# Altium project IOT_V1.2.PrjPcb
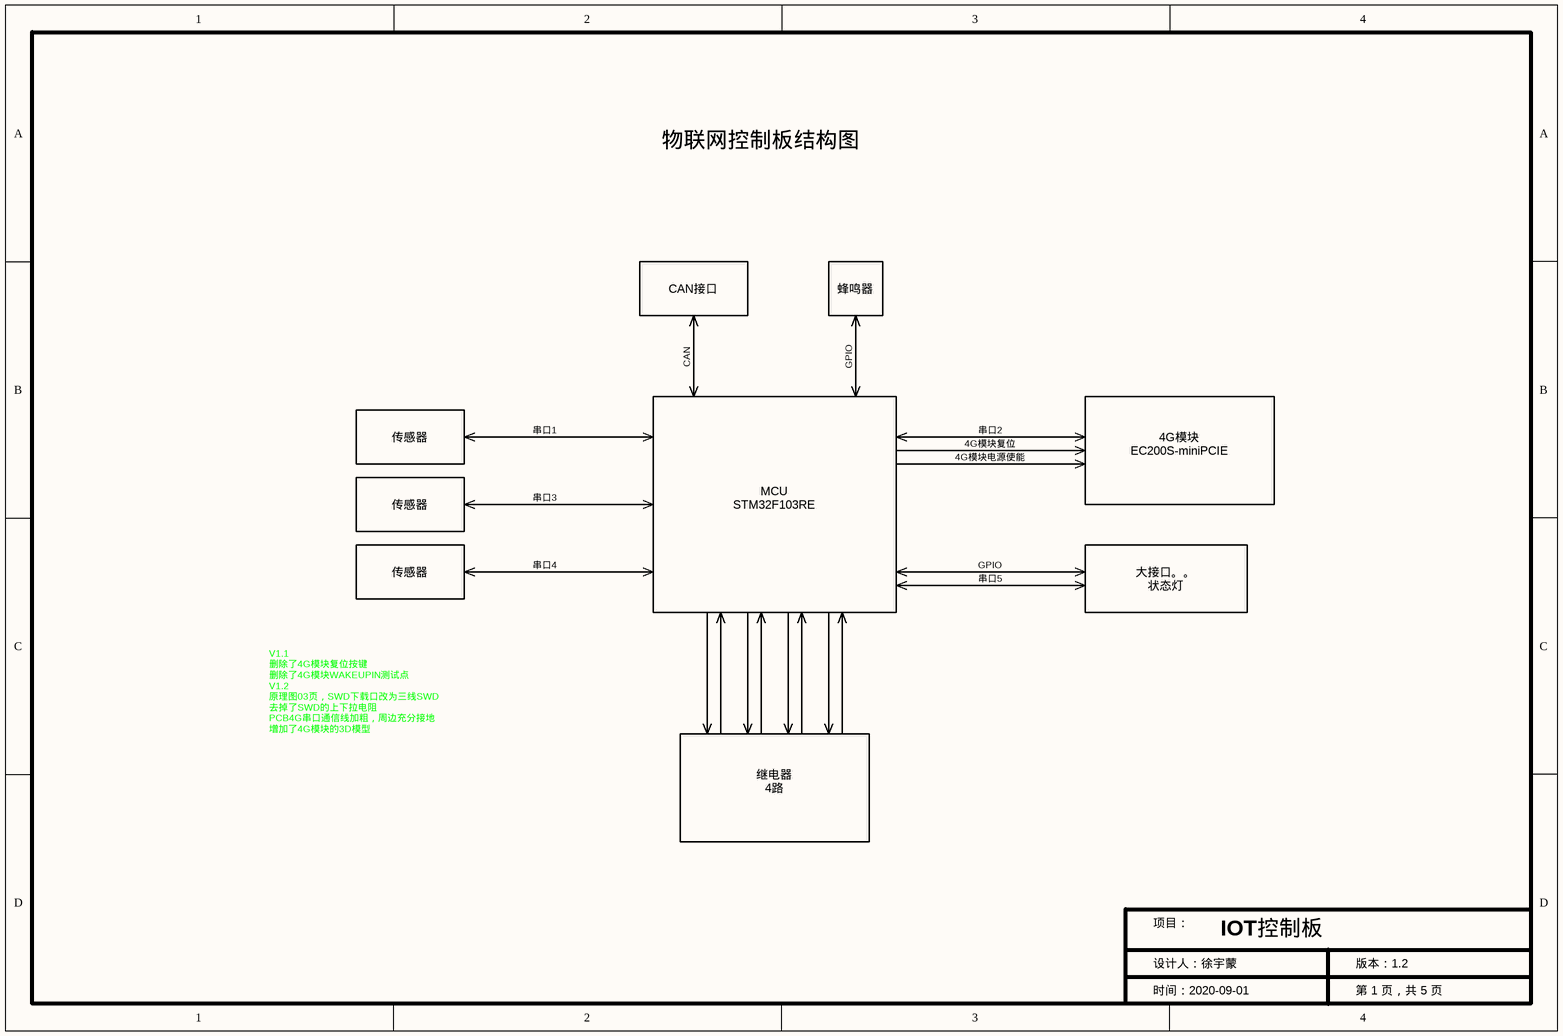
[diagram p0: 01_模块结构图.SchDoc]
5 sheets, 130 parts. Net scope: global (net labels, ports and power ports of the same name join across sheets).
Board file: IOT_V1.2.PcbDoc
Sheets:
  01_模块结构图.SchDoc
  02_电源部分.SchDoc
  03_MCU部分.SchDoc
  04_4G通信模块与外围电路.SchDoc
  05_外部接口与其他部分.SchDoc

## Sheet 01_模块结构图.SchDoc
size A4; DocumentNumber: 1; SheetNumber: 1; SheetTotal: 4

### Notes on the sheet
- 物联网控制板结构图
- CAN接口
- 蜂鸣器
- CAN
- GPIO
- 传感器
- 串口1
- 串口2
- 4G模块复位
- 4G模块
- EC200S-miniPCIE
- 串口3
- MCU
- STM32F103RE
- 4G模块电源使能
- 串口4
- 串口5
- 大接口。。
- 状态灯
- 继电器
- 4路
- V1.1
  删除了4G模块复位按键
  删除了4G模块WAKEUPIN测试点
  V1.2
  原理图03页，SWD下载口改为三线SWD
  去掉了SWD的上下拉电阻
  PCB4G串口通信线加粗，周边充分接地
  增加了4G模块的3D模型
- 项目：
- IOT控制板
- 时间：2020-09-01
- 设计人：徐宇蒙
- 第 1 页，共 5 页
- 版本：1.2

## Sheet 02_电源部分.SchDoc
size A4; DocumentNumber: 2; SheetNumber: 2; SheetTotal: 4
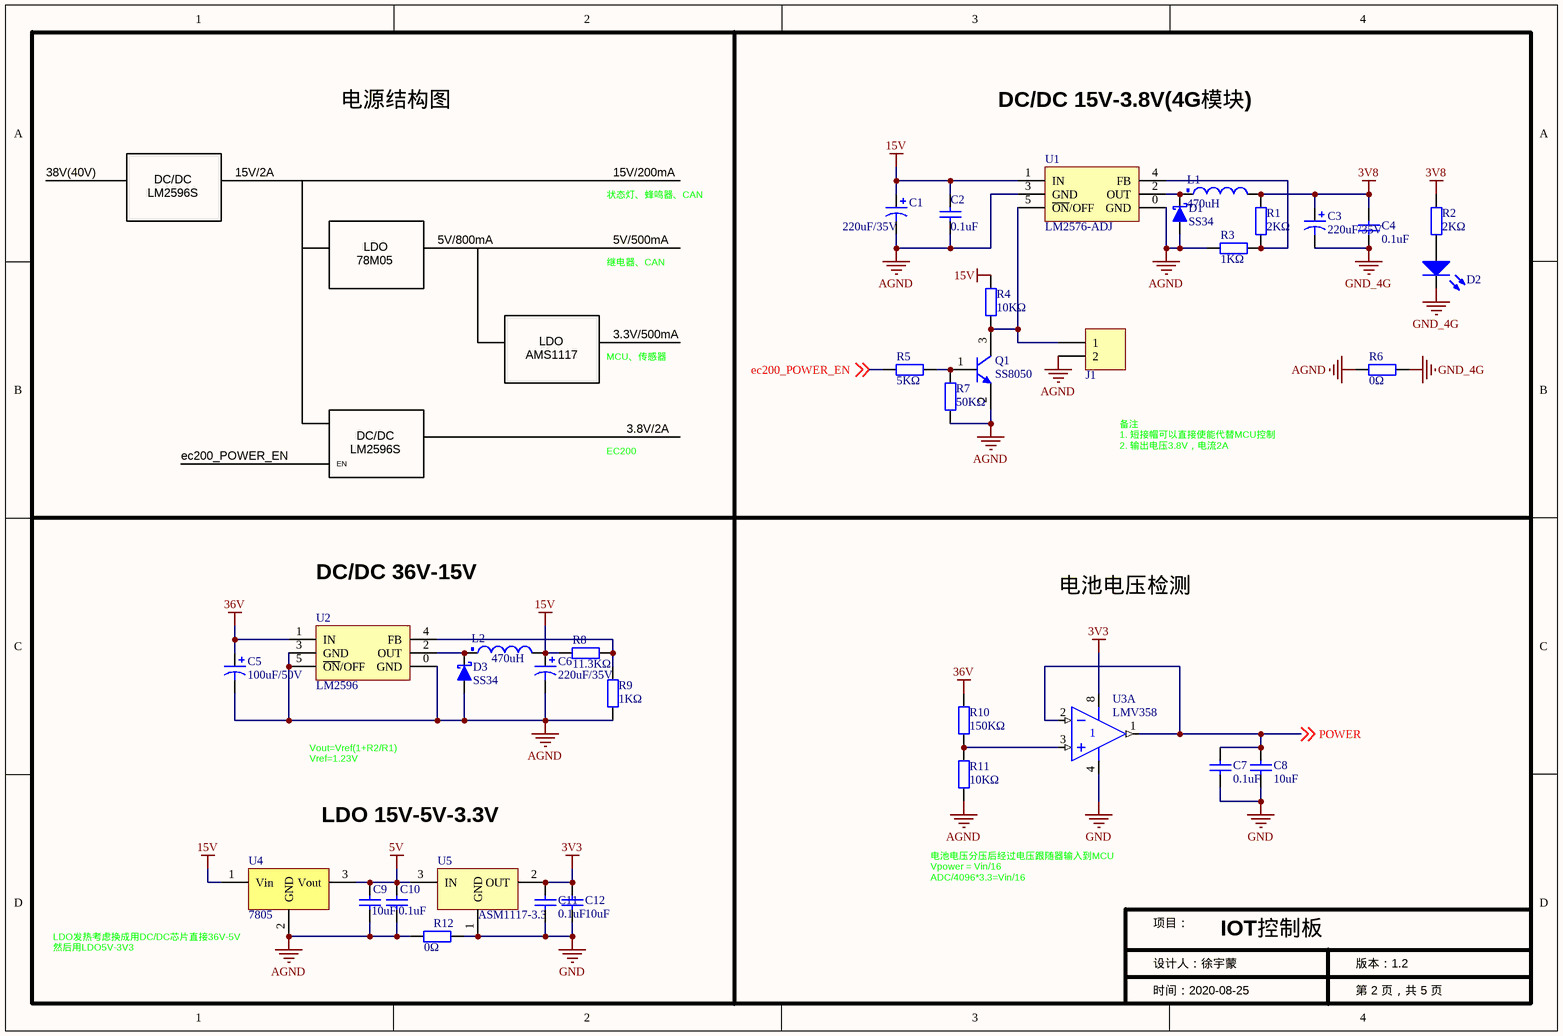
[diagram p1: 02_电源部分.SchDoc]

### Parts
C1  value 220uF/35V  [Cap8x10.5mm]  (hidden comment: Cap Pol)
C2  value 0.1uF  [CAP-0603]  (hidden comment: Cap)
C3  value 220uF/35V  [Cap8x10.5mm]  (hidden comment: Cap Pol)
C4  value 0.1uF  [CAP-0603]  (hidden comment: Cap)
C5  value 100uF/50V  [Cap8x10.5mm]  (hidden comment: Cap Pol)
C6  value 220uF/35V  [Cap8x10.5mm]  (hidden comment: Cap Pol)
C7  value 0.1uF  [CAP-0603]  (hidden comment: Cap)
C8  value 10uF  [CAP-0603]  (hidden comment: Cap)
C9  value 10uF  [CAP-0603]  (hidden comment: Cap)
C10  value 0.1uF  [CAP-0603]  (hidden comment: Cap)
C11  value 0.1uF  [CAP-0603]  (hidden comment: Cap)
C12  value 10uF  [CAP-0603]  (hidden comment: Cap)
D1  SS34  [SMA(DO-214AC)]
D2  LED  [LED_0805]  (value not drawn)
D3  SS34  [SMA(DO-214AC)]
J1  Header 2  [Header_2X1_2.54]  (value not drawn)
L1  value 470uH  [CD43]  (hidden comment: Inductor)
L2  value 470uH  [CD43]  (hidden comment: Inductor)
Q1  SS8050  [SOT-23]
R1  value 2KΩ  [0603]  (hidden comment: Res)
R2  value 2KΩ  [0603]  (hidden comment: Res)
R3  value 1KΩ  [0603]  (hidden comment: Res)
R4  value 10KΩ  [0603]  (hidden comment: Res)
R5  value 5KΩ  [0603]  (hidden comment: Res)
R6  value 0Ω  [0805]  (hidden comment: Res)
R7  value 50KΩ  [0603]  (hidden comment: Res)
R8  value 11.3KΩ  [0603]  (hidden comment: Res)
R9  value 1KΩ  [0603]  (hidden comment: Res)
R10  value 150KΩ  [0603]  (hidden comment: Res)
R11  value 10KΩ  [0603]  (hidden comment: Res)
R12  value 0Ω  [0805]  (hidden comment: Res)
U1  LM2576-ADJ  [TO-263-5 无背面散热]
U2  LM2596  [TO-263-5 无背面散热]
U3  LMV358  [OPA2350]  (part A of 2)
U4  7805  [TO-252]
U5  ASM1117-3.3  [SOT-223]

### Nets
3V3: C11.2 C12.2 U3.8(V+) U5.2(OUT)
3V8: C3.1 C4.2 L1.2 R1.1 R2.2
5V: C9.2 C10.2 U4.3(Vout) U5.3(IN)
15V: C1.1 C2.2 C6.1 L2.2 R4.1 R8.1 U1.1(IN) U4.1(Vin)
36V: C5.1 R10.2 U2.1(IN)
AGND: C1.2 C2.1 C5.2 C6.2 C9.1 C10.1 D1.1(A) D3.1(A) J1.2 Q1.2(E) R3.1 R6.1 R7.2 R9.1 R11.1 R12.1 U1.0(GND) U1.3(GND) U2.0(GND) U2.3(GND) U2.5(~{ON}/OFF) U4.2(GND)
GND: C7.1 C8.1 C11.1 C12.1 R12.2 U3.4(V-) U5.1(GND)
GND_4G: C3.2 C4.1 D2.2(K) R6.2
ec200_POWER_EN: R5.1 ; off-sheet ec200_POWER_EN  [project net PA1]
POWER: C7.2 C8.2 U3.1(OUT) U3.2(IN-) ; off-sheet POWER  [project net PC0]
NetD1_2: D1.2(K) L1.1 U1.2(OUT)
NetD2_1: D2.1(A) R2.1
NetD3_2: D3.2(K) L2.1 U2.2(OUT)
NetJ1_1: J1.1 Q1.3(C) R4.2 U1.5(~{ON}/OFF)
NetQ1_1: Q1.1(B) R5.2 R7.1
NetR1_2: R1.2 R3.2 U1.4(FB)
NetR8_2: R8.2 R9.2 U2.4(FB)
NetR10_1: R10.1 R11.2 U3.3(IN+)

### Notes on the sheet
- 电源结构图
- DC/DC 15V-3.8V(4G模块)
- 38V(40V)
- 15V/2A
- 15V/200mA
- LM2596S
- DC/DC
- LDO
- 5V/800mA
- 状态灯、蜂鸣器、CAN
- 5V/500mA
- 78M05
- 继电器、CAN
- AMS1117
- MCU、传感器
- 3.3V/500mA
- 3.8V/2A
- ec200_POWER_EN
- EN
- EC200
- 备注
  1. 短接帽可以直接使能代替MCU控制
  2. 输出电压3.8V，电流2A
- DC/DC 36V-15V
- 电池电压检测
- Vout=Vref(1+R2/R1)
  Vref=1.23V
- LDO 15V-5V-3.3V
- 电池电压分压后经过电压跟随器输入到MCU
  Vpower = Vin/16
  ADC/4096*3.3=Vin/16
- 项目：
- IOT控制板
- (near U4) LDO发热考虑换成用DC/DC芯片直接36V-5V
  然后用LDO5V-3V3
- 设计人：徐宇蒙
- 时间：2020-08-25
- 第 2 页，共 5 页
- 版本：1.2

### Library data of the parts
C1 C3 C5 C6 = Cap Pol: 贴片电解电容 8*10.5mm; Published: 8-Jun-2000; LatestRevisionDate: 17-Jul-2002; LatestRevisionNote: Re-released for DXP Platform.; PackageReference: POLAR0.8; Publisher: Altium Limited
C2 C4 C7-C12 = Cap: 无极性电容; Published: 8-Jun-2000; LatestRevisionDate: 17-Jul-2002; LatestRevisionNote: Re-released for DXP Platform.; PackageReference: RAD-0.3; Publisher: Altium Limited
D1 D3 = D Schottky: Schottky Diode; Published: 8-Jun-2000; LatestRevisionDate: 17-Jul-2002; LatestRevisionNote: Re-released for DXP Platform.; PackageReference: SMB; Publisher: Altium Limited; Code_JEDEC: DO-214-AA
D2 = LED: 发光二极管; Published: 8-Jun-2000; LatestRevisionDate: 08-Jul-2005; LatestRevisionNote: Mech Layer 1 removed.; PackageReference: LED-0; Publisher: Altium Limited
J1 = Header 2: 接插件; LatestRevisionDate: 17-Jul-2002; LatestRevisionNote: Re-released for DXP Platform.; Publisher: Altium Limited
L1 L2 = Inductor: 贴片功率电感; Code_IEC: 1005; Published: 8-Jun-2000; LatestRevisionDate: 17-Jul-2002; LatestRevisionNote: Re-released for DXP Platform.; PackageReference: 0402-A; Publisher: Altium Limited; Code_JEITA: 0402
Q1 = SS8050: NPN贴片三极管; Published: 8-Jun-2000; LatestRevisionDate: 15-Jan-2003; LatestRevisionNote: PCB Footprint 'BCY-W3/D4.7' replaced; DatasheetDocument: 1997; PackageDocument: Sep-1998; PackageReference: TO-92A; Publisher: Altium Limited; Code_JEDEC: TO-92A; ComponentLink1Description: Manufacturer Link; ComponentLink1URL: http://www.fairchildsemi.com/; ComponentLink2Description: Datasheet; ComponentLink2URL: http://www.fairchildsemi.com/ds/2N%2F2N3904.pdf
R1-R12 = Res: 贴片电阻; Published: 8-Jun-2000; LatestRevisionDate: 17-Jul-2002; LatestRevisionNote: Re-released for DXP Platform.; PackageReference: AXIAL-0.4; Publisher: Altium Limited
U1 = LM2576
U2 = LM2596: DC/DC
U4 = 7805: 三端稳压器7805
U5 = ASM1117: 3.3V稳压芯片
U3 = LMV358: Published: 17-Jul-2002; LatestRevisionDate: 13-Apr-2006; LatestRevisionNote: IPC-7351 Footprint Added.; DatasheetVersion: 1988; PackageReference: 751-02; Publisher: Altium Limited; PackageDescription: 8-Pin Small Outline Integrated Circuit 1.27 mm Pitch; Code_JEDEC: MS-012-AA; Code_IPC: SOIC127P600-8; ComponentLink1Description: Manufacturer Link; ComponentLink1URL: http://www.onsemi.com/site/products/parametrics/0,4446,251,00.html; ComponentLink2Description: Datasheet; ComponentLink2URL: http://www.onsemi.com/pub/Collateral/LM358-D.PDF

## Sheet 03_MCU部分.SchDoc
size A4; DocumentNumber: 3; SheetNumber: 3; SheetTotal: 4
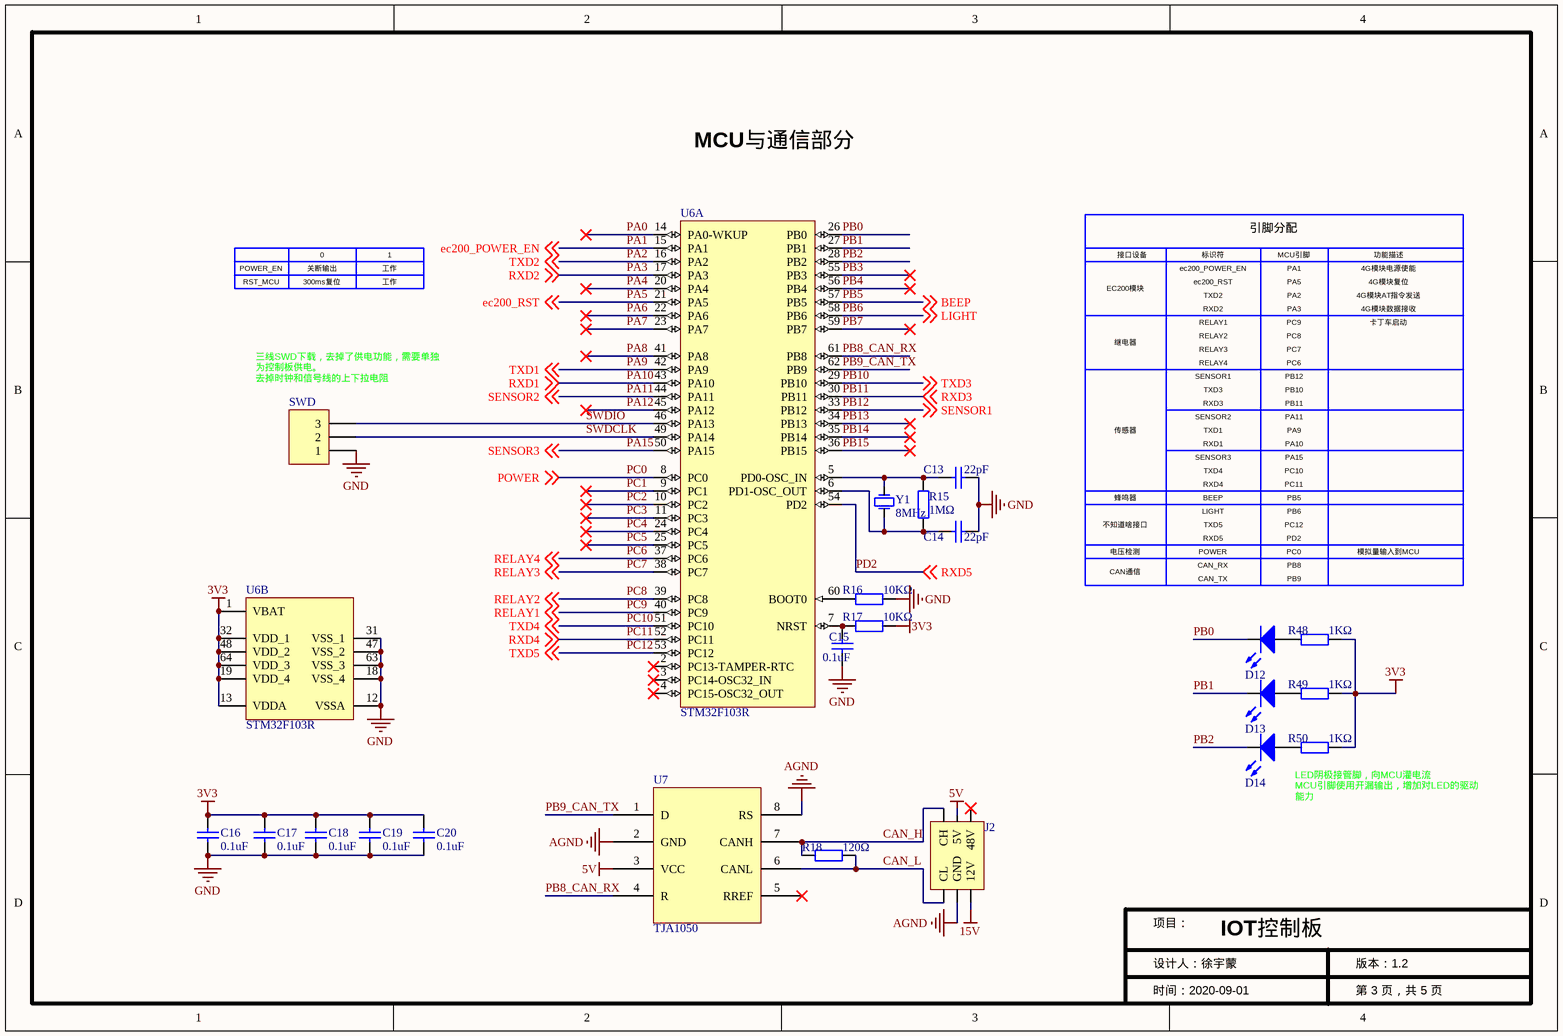
[diagram p2: 03_MCU部分.SchDoc]

### Parts
C13  value 22pF  [CAP-0603]  (hidden comment: Cap)
C14  value 22pF  [CAP-0603]  (hidden comment: Cap)
C15  value 0.1uF  [CAP-0603]  (hidden comment: Cap)
C16  value 0.1uF  [CAP-0603]  (hidden comment: Cap)
C17  value 0.1uF  [CAP-0603]  (hidden comment: Cap)
C18  value 0.1uF  [CAP-0603]  (hidden comment: Cap)
C19  value 0.1uF  [CAP-0603]  (hidden comment: Cap)
C20  value 0.1uF  [CAP-0603]  (hidden comment: Cap)
D12  LED  [LED_0805]  (value not drawn)
D13  LED  [LED_0805]  (value not drawn)
D14  LED  [LED_0805]  (value not drawn)
J2  标准接口  [标准接口-直插-灰色]  (value not drawn)
R15  value 1MΩ  [0603]  (hidden comment: Res)
R16  value 10KΩ  [0603]  (hidden comment: Res)
R17  value 10KΩ  [0603]  (hidden comment: Res)
R18  value 120Ω  [0603]  (hidden comment: Res)
R48  value 1KΩ  [0603]  (hidden comment: Res)
R49  value 1KΩ  [0603]  (hidden comment: Res)
R50  value 1KΩ  [0603]  (hidden comment: Res)
SWD  Header3  [Header_3X1_2.54_排针]  (value not drawn)
U6  STM32F103R  [LQFP64]  (parts A,B of 2)
U7  TJA1050  [TJA1050]
Y1  value 8MHz  [X-SM49]  (hidden comment: XTAL)

### Nets
3V3: C16.2 C17.2 C18.2 C19.2 C20.2 R17.1 R48.1 R49.1 R50.1 U6.1(VBAT) U6.13(VDDA) U6.19(VDD_4) U6.32(VDD_1) U6.48(VDD_2) U6.64(VDD_3)
5V: J2.3(5V) U7.3(VCC)
15V: J2.2(12V)
AGND: J2.4(GND) U7.2(GND) U7.8(RS)
GND: C13.1 C14.1 C15.1 C16.1 C17.1 C18.1 C19.1 C20.1 R16.1 SWD.1 U6.12(VSSA) U6.18(VSS_4) U6.31(VSS_1) U6.47(VSS_2) U6.63(VSS_3)
CAN_H: J2.5(CH) R18.2 U7.7(CANH)
CAN_L: J2.6(CL) R18.1 U7.6(CANL)
PA0: U6.14(PA0-WKUP)
PA1: U6.15(PA1) ; off-sheet ec200_POWER_EN  [also labelled ec200_POWER_EN]
PA2: U6.16(PA2) ; off-sheet TXD2  [also labelled TXD2]
PA3: U6.17(PA3) ; off-sheet RXD2  [also labelled RXD2]
PA4: U6.20(PA4)
PA5: U6.21(PA5) ; off-sheet ec200_RST  [also labelled ec200_RST]
PA6: U6.22(PA6)
PA7: U6.23(PA7)
PA8: U6.41(PA8)
PA9: U6.42(PA9) ; off-sheet TXD1  [also labelled TXD1]
PA10: U6.43(PA10) ; off-sheet RXD1  [also labelled RXD1]
PA11: U6.44(PA11) ; off-sheet SENSOR2  [also labelled SENSOR2]
PA12: U6.45(PA12)
PA15: U6.50(PA15) ; off-sheet SENSOR3  [also labelled SENSOR3]
PB0: D12.2(K) U6.26(PB0)
PB1: D13.2(K) U6.27(PB1)
PB2: D14.2(K) U6.28(PB2)
PB3: U6.55(PB3)
PB4: U6.56(PB4)
PB5: U6.57(PB5) ; off-sheet BEEP  [also labelled BEEP]
PB6: U6.58(PB6) ; off-sheet LIGHT  [also labelled LIGHT]
PB7: U6.59(PB7)
PB8_CAN_RX: U6.61(PB8) U7.4(R)
PB9_CAN_TX: U6.62(PB9) U7.1(D)
PB10: U6.29(PB10) ; off-sheet TXD3  [also labelled TXD3]
PB11: U6.30(PB11) ; off-sheet RXD3  [also labelled RXD3]
PB12: U6.33(PB12) ; off-sheet SENSOR1  [also labelled SENSOR1]
PB13: U6.34(PB13)
PB14: U6.35(PB14)
PB15: U6.36(PB15)
PC0: U6.8(PC0) ; off-sheet POWER  [also labelled POWER]
PC1: U6.9(PC1)
PC2: U6.10(PC2)
PC3: U6.11(PC3)
PC4: U6.24(PC4)
PC5: U6.25(PC5)
PC6: U6.37(PC6) ; off-sheet RELAY4  [also labelled RELAY4]
PC7: U6.38(PC7) ; off-sheet RELAY3  [also labelled RELAY3]
PC8: U6.39(PC8) ; off-sheet RELAY2  [also labelled RELAY2]
PC9: U6.40(PC9) ; off-sheet RELAY1  [also labelled RELAY1]
PC10: U6.51(PC10) ; off-sheet TXD4  [also labelled TXD4]
PC11: U6.52(PC11) ; off-sheet RXD4  [also labelled RXD4]
PC12: U6.53(PC12) ; off-sheet TXD5  [also labelled TXD5]
PD2: U6.54(PD2) ; off-sheet RXD5  [also labelled RXD5]
SWDCLK: SWD.2 U6.49(PA14)
SWDIO: SWD.3 U6.46(PA13)
NetC13_2: C13.2 R15.2 U6.5(PD0-OSC_IN) Y1.2
NetC14_2: C14.2 R15.1 U6.6(PD1-OSC_OUT) Y1.1
NetC15_2: C15.2 R17.2 U6.7(NRST)
NetD12_1: D12.1(A) R48.2
NetD13_1: D13.1(A) R49.2
NetD14_1: D14.1(A) R50.2
NetR16_2: R16.2 U6.60(BOOT0)

Not connected (* = marked no-connect by the designer): J2 1(48V)*; U6 2(PC13-TAMPER-RTC)* 3(PC14-OSC32_IN)* 4(PC15-OSC32_OUT)*; U7 5(RREF)*

### Notes on the sheet
- MCU与通信部分
- 0
- 1
- 接口设备
- 标识符
- 引脚分配
- MCU引脚
- 功能描述
- POWER_EN
- RST_MCU
- 关断输出
- 300ms复位
- 工作
- EC200模块
- ec200_POWER_EN
- ec200_RST
- TXD2
- RXD2
- PA1
- PA5
- PA2
- PA3
- 4G模块电源使能
- 4G模块复位
- 4G模块AT指令发送
- 4G模块数据接收
- 继电器
- RELAY1
- RELAY2
- RELAY3
- RELAY4
- SENSOR1
- TXD3
- PB10
- PB12
- PC6
- PC7
- PC8
- PC9
- 卡丁车启动
- (near SWD) 三线SWD下载，去掉了供电功能，需要单独为控制板供电。
  去掉时钟和信号线的上下拉电阻
- 传感器
- RXD3
- SENSOR2
- TXD1
- RXD1
- PB11
- PA9
- PA10
- PA11
- 蜂鸣器
- 不知道啥接口
- SENSOR3
- BEEP
- LIGHT
- TXD5
- TXD4
- RXD4
- PC12
- PC10
- PC11
- PA15
- PB6
- PB5
- 电压检测
- CAN通信
- RXD5
- POWER
- CAN_RX
- CAN_TX
- PD2
- PC0
- PB8
- PB9
- 模拟量输入到MCU
- LED阴极接管脚，向MCU灌电流
  MCU引脚使用开漏输出，增加对LED的驱动能力
- 项目：
- IOT控制板
- 设计人：徐宇蒙
- 时间：2020-09-01
- 第 3 页，共 5 页
- 版本：1.2

### Library data of the parts
C13-C20 = Cap: 无极性电容; Published: 8-Jun-2000; LatestRevisionDate: 17-Jul-2002; LatestRevisionNote: Re-released for DXP Platform.; PackageReference: RAD-0.3; Publisher: Altium Limited
D12-D14 = LED: 发光二极管; Published: 8-Jun-2000; LatestRevisionDate: 08-Jul-2005; LatestRevisionNote: Mech Layer 1 removed.; PackageReference: LED-0; Publisher: Altium Limited
R15-R18 R48-R50 = Res: 贴片电阻; Published: 8-Jun-2000; LatestRevisionDate: 17-Jul-2002; LatestRevisionNote: Re-released for DXP Platform.; PackageReference: AXIAL-0.4; Publisher: Altium Limited
SWD = Header3: 接插件
U6 = STM32F103R: STM32单片机64引脚; PartNumber: STM32F103RGT6; A/D Converter: 3x12-bit (16 Channel); Core: ARM Cortex-M3; D/A Converter: 2x12-bit (2 Channel); FLASH Size (Prog) (kB): 1024; I/Os (High Current): 51; Internal RAM Size (kB): 96; Operating Frequency(F) (Processor speed) (MHz): 72; Packing: Tray; Supply Voltage(Vcc) min (V): 2; DatasheetVersion: Rev. 3; PackageVersion: Rev. 4, 06/2013; PackageReference: LQFP64; PackageDescription: 64-Pin Low Profile Quad Flat Package, 10 x 10 mm Body, 0.5 mm Pitch; Supplier 1: Digi-Key; Supplier Part Number 1: 497-11118-ND; Supplier 2: Farnell; Supplier Part Number 2: 2215220; Supplier 3: Newark; Supplier Part Number 3: 21T4016; Supplier 4: Mouser; Supplier Part Number 4: 511-STM32F103RGT6; Mounting Technology: Surface Mount; ComponentLink1Description: Manufacturer URL; ComponentLink1URL: http://www.st.com/web/en/home.html; ComponentLink2Description: Datasheet; ComponentLink2URL: http://www.st.com/st-web-ui/static/active/en/resource/technical/document/datasheet/CD00253742.pdf; ComponentLink3Description: Package Specification; ComponentLink3URL: http://www.st.com/st-web-ui/static/active/en/resource/technical/document/datasheet/DM00037051.pdf
U7 = TJA1050: CAN收发器芯片
Y1 = XTAL: 晶振; Published: 8-Jun-2000; LatestRevisionDate: 17-Jul-2002; LatestRevisionNote: Re-released for DXP Platform.; PackageReference: R38; Publisher: Altium Limited

## Sheet 04_4G通信模块与外围电路.SchDoc
size A4; DocumentNumber: 4; SheetNumber: 4; SheetTotal: 4
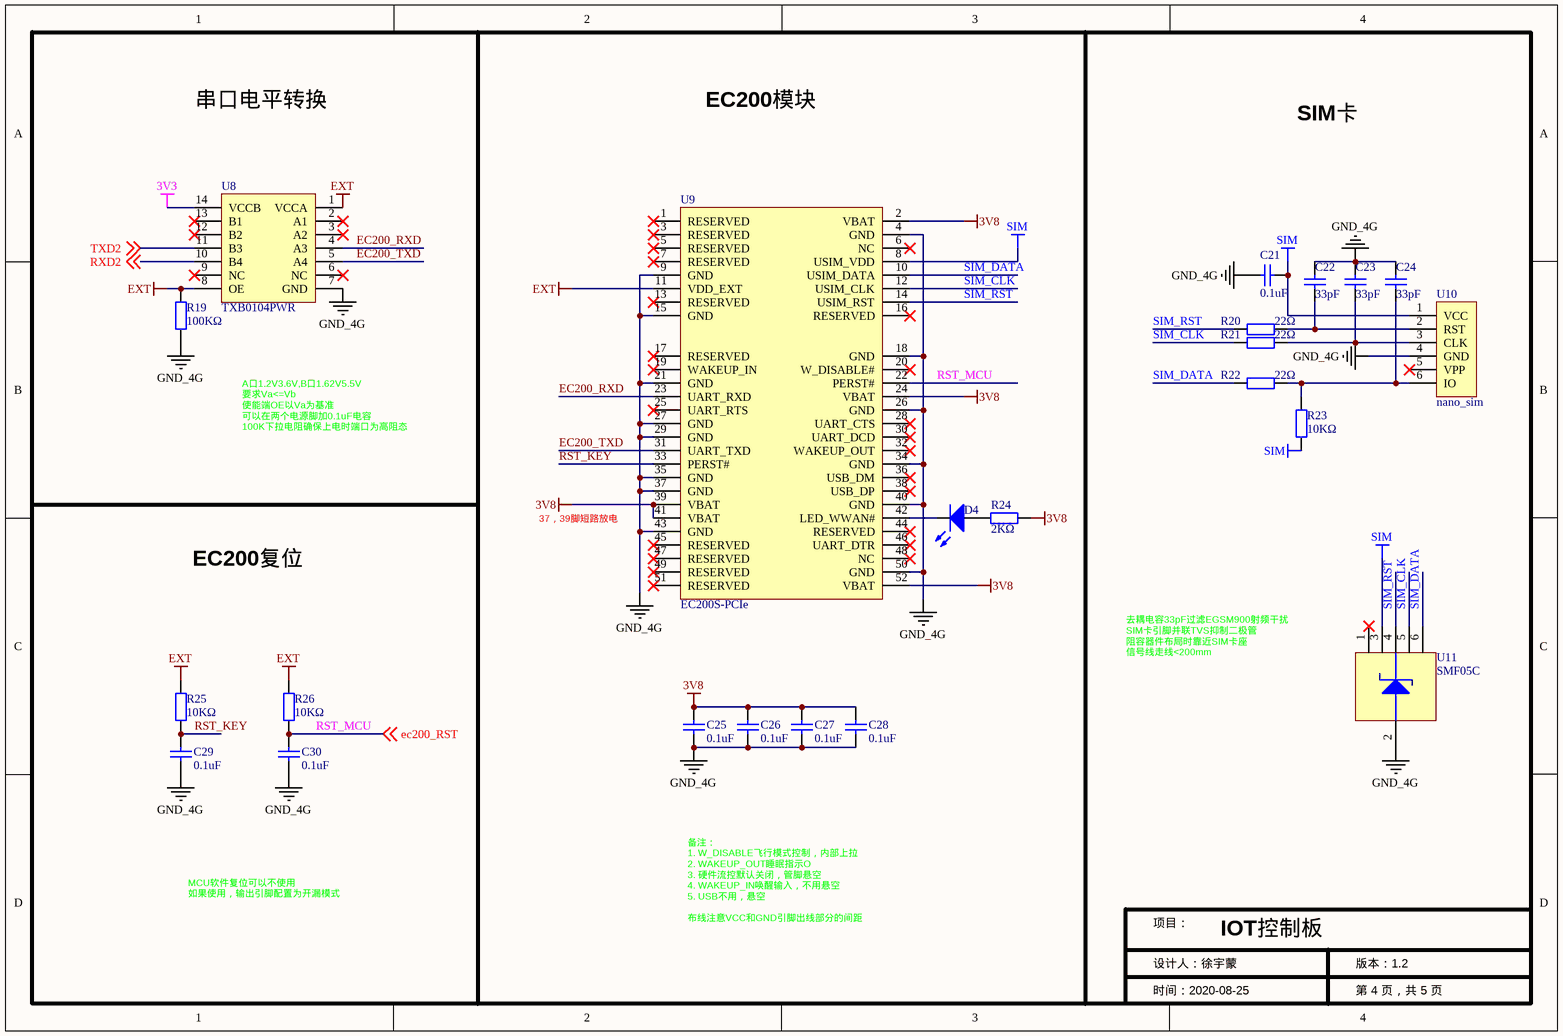
[diagram p3: 04_4G通信模块与外围电路.SchDoc]

### Parts
C21  value 0.1uF  [CAP-0603]  (hidden comment: Cap)
C22  value 33pF  [CAP-0603]  (hidden comment: Cap)
C23  value 33pF  [CAP-0603]  (hidden comment: Cap)
C24  value 33pF  [CAP-0603]  (hidden comment: Cap)
C25  value 0.1uF  [CAP-0603]  (hidden comment: Cap)
C26  value 0.1uF  [CAP-0603]  (hidden comment: Cap)
C27  value 0.1uF  [CAP-0603]  (hidden comment: Cap)
C28  value 0.1uF  [CAP-0603]  (hidden comment: Cap)
C29  value 0.1uF  [CAP-0603]  (hidden comment: Cap)
C30  value 0.1uF  [CAP-0603]  (hidden comment: Cap)
D4  LED  [LED_0805]  (value not drawn)
R19  value 100KΩ  [0603]  (hidden comment: Res)
R20  value 22Ω  [0603]  (hidden comment: Res)
R21  value 22Ω  [0603]  (hidden comment: Res)
R22  value 22Ω  [0603]  (hidden comment: Res)
R23  value 10KΩ  [0603]  (hidden comment: Res)
R24  value 2KΩ  [0603]  (hidden comment: Res)
R25  value 10KΩ  [0603]  (hidden comment: Res)
R26  value 10KΩ  [0603]  (hidden comment: Res)
U8  TXB0104PWR  [TSSOP-14]
U9  EC200S-PCIe  [miniPCIe1]
U10  nano_sim  [Nano_SIM_6P]
U11  SMF05C  [SOT-363]

### Nets
3V3: U8.14(VCCB)
3V8: C25.2 C26.2 C27.2 C28.2 R24.1 U9.2(VBAT) U9.24(VBAT) U9.39(VBAT) U9.41(VBAT) U9.52(VBAT)
EXT: R19.2 R25.2 R26.1 U8.1(VCCA) U8.8(OE) U9.11(VDD_EXT)
GND_4G: C21.2 C22.1 C23.1 C24.2 C25.1 C26.1 C27.1 C28.1 C29.1 C30.2 R19.1 U8.7(GND) U9.4(GND) U9.9(GND) U9.15(GND) U9.18(GND) U9.21(GND) U9.26(GND) U9.27(GND) U9.29(GND) U9.34(GND) U9.35(GND) U9.37(GND) U9.40(GND) U9.43(GND) U9.50(GND) U10.4(GND) U11.2(gnd)
SIM: C21.1 R23.2 U9.8(USIM_VDD) U10.1(VCC) U11.3(gnd)
ec200_RST: C30.1 R26.2 U9.22(PERST#) ; off-sheet ec200_RST  [also labelled RST_MCU]  [project net PA5]
EC200_RXD: U8.4(A3) U9.23(UART_RXD)
EC200_TXD: U8.5(A4) U9.31(UART_TXD)
RST_KEY: C29.2 R25.1 U9.33(PERST#)
RXD2: U8.10(B4) ; off-sheet RXD2  [project net PA3]
SIM_CLK: R21.1 U9.12(USIM_CLK) U11.5(gnd)
SIM_DATA: R22.1 U9.10(USIM_DATA) U11.6(gnd)
SIM_RST: R20.1 U9.14(USIM_RST) U11.4(gnd)
TXD2: U8.11(B3) ; off-sheet TXD2  [project net PA2]
NetC22_2: C22.2 R20.2 U10.2(RST)
NetC23_2: C23.2 R21.2 U10.3(CLK)
NetC24_1: C24.1 R22.2 R23.1 U10.6(IO)
NetD4_1: D4.1(A) R24.2
NetD4_2: D4.2(K) U9.42(LED_WWAN#)

Not connected (* = marked no-connect by the designer): U8 2(A1)* 3(A2)* 6(NC)* 9(NC)* 12(B2)* 13(B1)*; U9 1(RESERVED)* 3(RESERVED)* 5(RESERVED)* 6(NC)* 7(RESERVED)* 13(RESERVED)* 16(RESERVED)* 17(RESERVED)* 19(WAKEUP_IN)* 20(W_DISABLE#)* 25(UART_RTS)* 28(UART_CTS)* 30(UART_DCD)* 32(WAKEUP_OUT)* 36(USB_DM)* 38(USB_DP)* 44(RESERVED)* 45(RESERVED)* 46(UART_DTR)* 47(RESERVED)* 48(NC)* 49(RESERVED)* 51(RESERVED)*; U10 5(VPP)*; U11 1(gnd)*

### Notes on the sheet
- 串口电平转换
- EC200模块
- SIM卡
- A口1.2V3.6V,B口1.62V5.5V
  要求Va<=Vb
  使能端OE以Va为基准
  可以在两个电源脚加0.1uF电容
  100K下拉电阻确保上电时端口为高阻态
- EC200复位
- (near U9) 37，39脚短路放电
- (near U11) 去耦电容33pF过滤EGSM900射频干扰
  SIM卡引脚并联TVS抑制二极管
  阻容器件布局时靠近SIM卡座
  信号线走线<200mm
- MCU软件复位可以不使用
  如果使用，输出引脚配置为开漏模式
- 项目：
- IOT控制板
- 备注：
  1. W_DISABLE飞行模式控制，内部上拉
  2. WAKEUP_OUT睡眠指示O
  3. 硬件流控默认关闭，管脚悬空
  4. WAKEUP_IN唤醒输入，不用悬空
  5. USB不用，悬空
  布线注意VCC和GND引脚出线部分的间距
- 设计人：徐宇蒙
- 时间：2020-08-25
- 第 4 页，共 5 页
- 版本：1.2

### Library data of the parts
C21-C30 = Cap: 无极性电容; Published: 8-Jun-2000; LatestRevisionDate: 17-Jul-2002; LatestRevisionNote: Re-released for DXP Platform.; PackageReference: RAD-0.3; Publisher: Altium Limited
D4 = LED: 发光二极管; Published: 8-Jun-2000; LatestRevisionDate: 08-Jul-2005; LatestRevisionNote: Mech Layer 1 removed.; PackageReference: LED-0; Publisher: Altium Limited
R19-R26 = Res: 贴片电阻; Published: 8-Jun-2000; LatestRevisionDate: 17-Jul-2002; LatestRevisionNote: Re-released for DXP Platform.; PackageReference: AXIAL-0.4; Publisher: Altium Limited
U8 = TXB0104PWR: 电平转换芯片
U9 = EC200T-PCIe

## Sheet 05_外部接口与其他部分.SchDoc
size A4
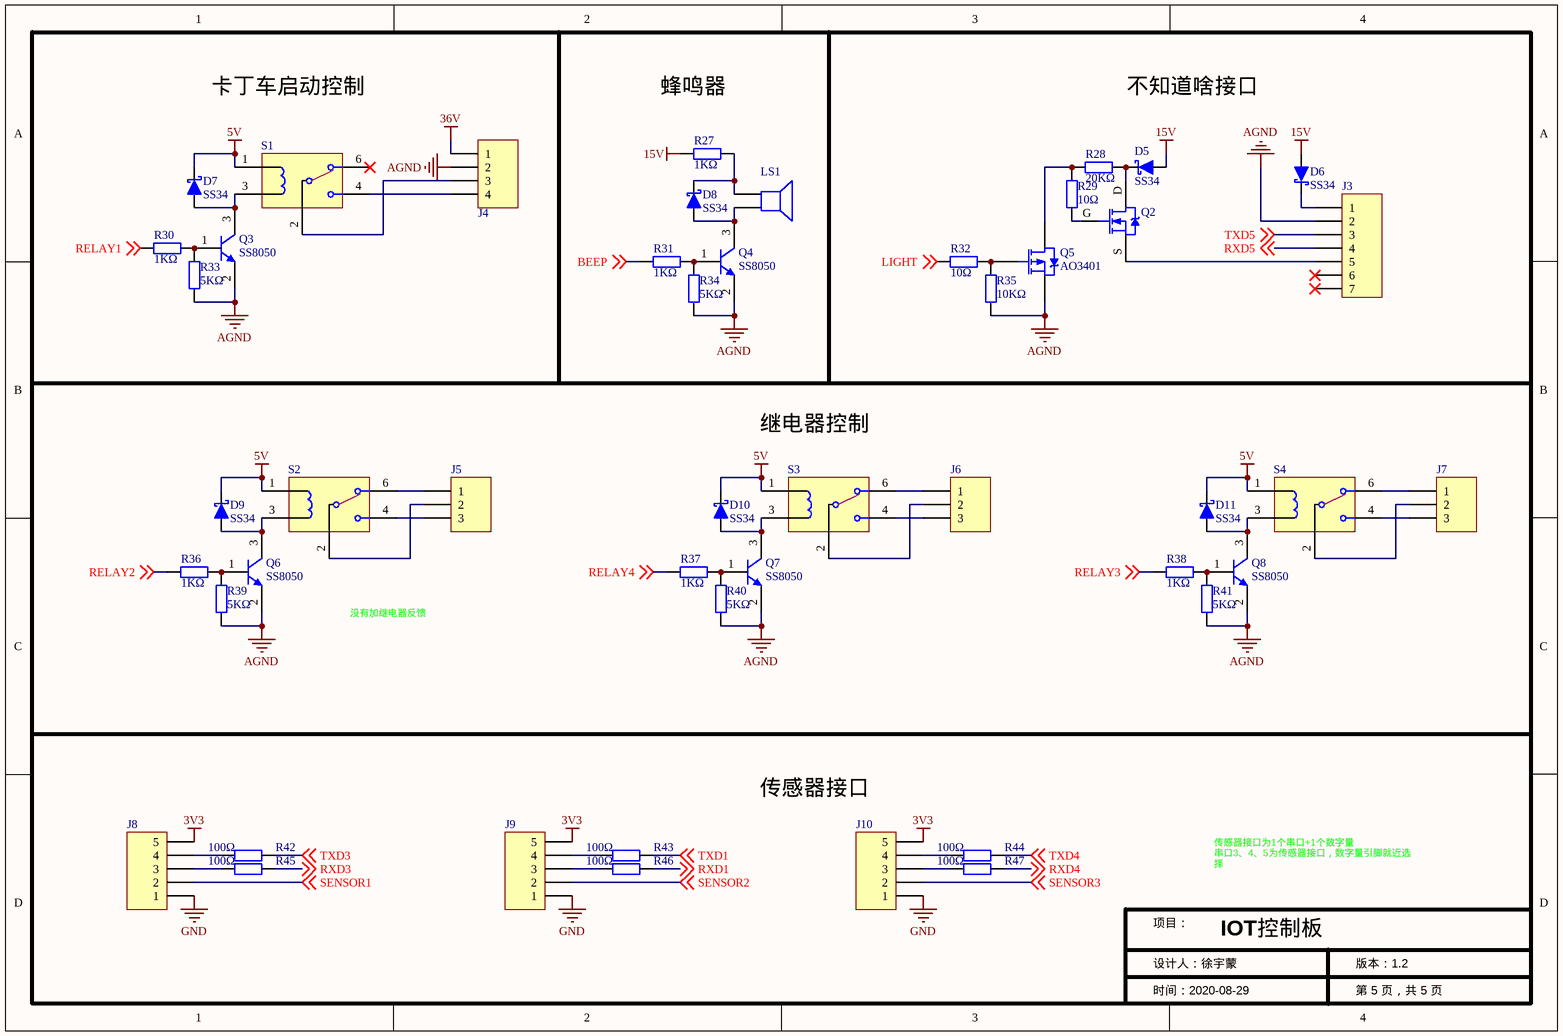
[diagram p4: 05_外部接口与其他部分.SchDoc]

### Parts
D5  SS34  [SMA(DO-214AC)]
D6  SS34  [SMA(DO-214AC)]
D7  SS34  [SMA(DO-214AC)]
D8  SS34  [SMA(DO-214AC)]
D9  SS34  [SMA(DO-214AC)]
D10  SS34  [SMA(DO-214AC)]
D11  SS34  [SMA(DO-214AC)]
J3  Header7  [Header_7X1_XH_2.54_弯针]  (value not drawn)
J4  Header 4  [Header_4P_XH_2.54_弯脚]  (value not drawn)
J5  Header3  [Header_3X1_XH_2.54_弯脚]  (value not drawn)
J6  Header3  [Header_3X1_XH_2.54_弯脚]  (value not drawn)
J7  Header3  [Header_3X1_XH_2.54_弯脚]  (value not drawn)
J8  Header5  [Header_5X1_XH_2.54_弯针]  (value not drawn)
J9  Header5  [Header_5X1_XH_2.54_弯针]  (value not drawn)
J10  Header5  [Header_5X1_XH_2.54_弯针]  (value not drawn)
LS1  蜂鸣器  [蜂鸣器 9*5mm]  (value not drawn)
Q2  AO3400  [SOT-23-MOSFET]  (value not drawn)
Q3  SS8050  [SOT-23]
Q4  SS8050  [SOT-23]
Q5  AO3401  [SOT-23-MOSFET]
Q6  SS8050  [SOT-23]
Q7  SS8050  [SOT-23]
Q8  SS8050  [SOT-23]
R27  value 1KΩ  [0603]  (hidden comment: Res)
R28  value 20KΩ  [0603]  (hidden comment: Res)
R29  value 10Ω  [0603]  (hidden comment: Res)
R30  value 1KΩ  [0603]  (hidden comment: Res)
R31  value 1KΩ  [0603]  (hidden comment: Res)
R32  value 10Ω  [0603]  (hidden comment: Res)
R33  value 5KΩ  [0603]  (hidden comment: Res)
R34  value 5KΩ  [0603]  (hidden comment: Res)
R35  value 10KΩ  [0603]  (hidden comment: Res)
R36  value 1KΩ  [0603]  (hidden comment: Res)
R37  value 1KΩ  [0603]  (hidden comment: Res)
R38  value 1KΩ  [0603]  (hidden comment: Res)
R39  value 5KΩ  [0603]  (hidden comment: Res)
R40  value 5KΩ  [0603]  (hidden comment: Res)
R41  value 5KΩ  [0603]  (hidden comment: Res)
R42  value 100Ω  [0603]  (hidden comment: Res)
R43  value 100Ω  [0603]  (hidden comment: Res)
R44  value 100Ω  [0603]  (hidden comment: Res)
R45  value 100Ω  [0603]  (hidden comment: Res)
R46  value 100Ω  [0603]  (hidden comment: Res)
R47  value 100Ω  [0603]  (hidden comment: Res)
S1  Delay  [SongLe_Relay]  (value not drawn)
S2  Delay  [SongLe_Relay]  (value not drawn)
S3  Delay  [SongLe_Relay]  (value not drawn)
S4  Delay  [SongLe_Relay]  (value not drawn)

### Nets
3V3: J8.5 J9.5 J10.5
5V: D7.2(K) D9.2(K) D10.2(K) D11.2(K) S1.1 S2.1 S3.1 S4.1
15V: D5.1(A) D6.1(A) R27.2
36V: J4.1
AGND: J3.2 J4.2 Q3.2(E) Q4.2(E) Q5.S Q6.2(E) Q7.2(E) Q8.2(E) R33.1 R34.1 R35.1 R39.1 R40.1 R41.1
GND: J8.1 J9.1 J10.1
BEEP: R31.2 ; off-sheet BEEP  [project net PB5]
LIGHT: R32.2 ; off-sheet LIGHT  [project net PB6]
RELAY1: R30.2 ; off-sheet RELAY1  [project net PC9]
RELAY2: R36.2 ; off-sheet RELAY2  [project net PC8]
RELAY3: R38.2 ; off-sheet RELAY3  [project net PC7]
RELAY4: R37.2 ; off-sheet RELAY4  [project net PC6]
RXD1: R46.2 ; off-sheet RXD1  [project net PA10]
RXD3: R45.2 ; off-sheet RXD3  [project net PB11]
RXD4: R47.2 ; off-sheet RXD4  [project net PC11]
RXD5: J3.4 ; off-sheet RXD5  [project net PD2]
SENSOR1: J8.2 ; off-sheet SENSOR1  [project net PB12]
SENSOR2: J9.2 ; off-sheet SENSOR2  [project net PA11]
SENSOR3: J10.2 ; off-sheet SENSOR3  [project net PA15]
TXD1: R43.2 ; off-sheet TXD1  [project net PA9]
TXD3: R42.2 ; off-sheet TXD3  [project net PB10]
TXD4: R44.2 ; off-sheet TXD4  [project net PC10]
TXD5: J3.3 ; off-sheet TXD5  [project net PC12]
NetD5_2: D5.2(K) Q2.D R28.1
NetD6_2: D6.2(K) J3.1
NetD7_1: D7.1(A) Q3.3(C) S1.3
NetD8_1: D8.1(A) LS1.2 Q4.3(C)
NetD8_2: D8.2(K) LS1.1 R27.1
NetD9_1: D9.1(A) Q6.3(C) S2.3
NetD10_1: D10.1(A) Q7.3(C) S3.3
NetD11_1: D11.1(A) Q8.3(C) S4.3
NetJ3_5: J3.5 Q2.S
NetJ4_3: J4.3 S1.2
NetJ4_4: J4.4 S1.4
NetJ5_1: J5.1 S2.6
NetJ5_2: J5.2 S2.2
NetJ5_3: J5.3 S2.4
NetJ6_1: J6.1 S3.6
NetJ6_2: J6.2 S3.2
NetJ6_3: J6.3 S3.4
NetJ7_1: J7.1 S4.6
NetJ7_2: J7.2 S4.2
NetJ7_3: J7.3 S4.4
NetJ8_3: J8.3 R45.1
NetJ8_4: J8.4 R42.1
NetJ9_3: J9.3 R46.1
NetJ9_4: J9.4 R43.1
NetJ10_3: J10.3 R47.1
NetJ10_4: J10.4 R44.1
NetQ2_G: Q2.G R29.2
NetQ3_1: Q3.1(B) R30.1 R33.2
NetQ4_1: Q4.1(B) R31.1 R34.2
NetQ5_D: Q5.D R28.2 R29.1
NetQ5_G: Q5.G R32.1 R35.2
NetQ6_1: Q6.1(B) R36.1 R39.2
NetQ7_1: Q7.1(B) R37.1 R40.2
NetQ8_1: Q8.1(B) R38.1 R41.2

Not connected (* = marked no-connect by the designer): J3 6* 7*; S1 6*

### Notes on the sheet
- 卡丁车启动控制
- 蜂鸣器
- 不知道啥接口
- 继电器控制
- 没有加继电器反馈
- 传感器接口
- 项目：
- 传感器接口为1个串口+1个数字量
  串口3、4、5为传感器接口，数字量引脚就近选择
- IOT控制板
- 设计人：徐宇蒙
- 时间：2020-08-29
- 第 5 页，共 5 页
- 版本：1.2

### Library data of the parts
D5-D11 = D Schottky: Schottky Diode; Published: 8-Jun-2000; LatestRevisionDate: 17-Jul-2002; LatestRevisionNote: Re-released for DXP Platform.; PackageReference: SMB; Publisher: Altium Limited; Code_JEDEC: DO-214-AA
J3 = Header7: 接插件
J4 = Header 4: 接插件; LatestRevisionDate: 17-Jul-2002; LatestRevisionNote: Re-released for DXP Platform.; Publisher: Altium Limited
J5-J7 = Header3: 接插件
J8-J10 = Header5: 接插件
LS1 = Speaker: Loudspeaker; Published: 24-Mar-1999; LatestRevisionDate: 17-Jul-2002; LatestRevisionNote: Re-released for DXP Platform.; Publisher: Altium Limited
Q2 = MOSFET-N: N沟道MOS管
Q3 Q4 Q6-Q8 = SS8050: NPN贴片三极管; Published: 8-Jun-2000; LatestRevisionDate: 15-Jan-2003; LatestRevisionNote: PCB Footprint 'BCY-W3/D4.7' replaced; DatasheetDocument: 1997; PackageDocument: Sep-1998; PackageReference: TO-92A; Publisher: Altium Limited; Code_JEDEC: TO-92A; ComponentLink1Description: Manufacturer Link; ComponentLink1URL: http://www.fairchildsemi.com/; ComponentLink2Description: Datasheet; ComponentLink2URL: http://www.fairchildsemi.com/ds/2N%2F2N3904.pdf
Q5 = MOSFET-P: P沟道MOS管
R27-R47 = Res: 贴片电阻; Published: 8-Jun-2000; LatestRevisionDate: 17-Jul-2002; LatestRevisionNote: Re-released for DXP Platform.; PackageReference: AXIAL-0.4; Publisher: Altium Limited
S1-S4 = SongLe_Relay: 松乐继电器

## Nets that join several sheets
3V3: 02_电源部分 (C11.2 C12.2 U3.8 U5.2), 03_MCU部分 (15 pins), 04_4G通信模块与外围电路 (U8.14), 05_外部接口与其他部分 (J8.5 J9.5 J10.5)
3V8: 02_电源部分 (5 pins), 04_4G通信模块与外围电路 (10 pins)
5V: 02_电源部分 (C9.2 C10.2 U4.3 U5.3), 03_MCU部分 (J2.3 U7.3), 05_外部接口与其他部分 (8 pins)
15V: 02_电源部分 (8 pins), 03_MCU部分 (J2.2), 05_外部接口与其他部分 (D5.1 D6.1 R27.2)
36V: 02_电源部分 (C5.1 R10.2 U2.1), 05_外部接口与其他部分 (J4.1)
AGND: 02_电源部分 (22 pins), 03_MCU部分 (J2.4 U7.2 U7.8), 05_外部接口与其他部分 (14 pins)
GND: 02_电源部分 (7 pins), 03_MCU部分 (15 pins), 05_外部接口与其他部分 (J8.1 J9.1 J10.1)
GND_4G: 02_电源部分 (C3.2 C4.1 D2.2 R6.2), 04_4G通信模块与外围电路 (28 pins)
PA1: 02_电源部分 (R5.1), 03_MCU部分 (U6.15)
PA2: 03_MCU部分 (U6.16), 04_4G通信模块与外围电路 (U8.11)
PA3: 03_MCU部分 (U6.17), 04_4G通信模块与外围电路 (U8.10)
PA5: 03_MCU部分 (U6.21), 04_4G通信模块与外围电路 (C30.1 R26.2 U9.22)
PA9: 03_MCU部分 (U6.42), 05_外部接口与其他部分 (R43.2)
PA10: 03_MCU部分 (U6.43), 05_外部接口与其他部分 (R46.2)
PA11: 03_MCU部分 (U6.44), 05_外部接口与其他部分 (J9.2)
PA15: 03_MCU部分 (U6.50), 05_外部接口与其他部分 (J10.2)
PB5: 03_MCU部分 (U6.57), 05_外部接口与其他部分 (R31.2)
PB6: 03_MCU部分 (U6.58), 05_外部接口与其他部分 (R32.2)
PB10: 03_MCU部分 (U6.29), 05_外部接口与其他部分 (R42.2)
PB11: 03_MCU部分 (U6.30), 05_外部接口与其他部分 (R45.2)
PB12: 03_MCU部分 (U6.33), 05_外部接口与其他部分 (J8.2)
PC0: 02_电源部分 (C7.2 C8.2 U3.1 U3.2), 03_MCU部分 (U6.8)
PC6: 03_MCU部分 (U6.37), 05_外部接口与其他部分 (R37.2)
PC7: 03_MCU部分 (U6.38), 05_外部接口与其他部分 (R38.2)
PC8: 03_MCU部分 (U6.39), 05_外部接口与其他部分 (R36.2)
PC9: 03_MCU部分 (U6.40), 05_外部接口与其他部分 (R30.2)
PC10: 03_MCU部分 (U6.51), 05_外部接口与其他部分 (R44.2)
PC11: 03_MCU部分 (U6.52), 05_外部接口与其他部分 (R47.2)
PC12: 03_MCU部分 (U6.53), 05_外部接口与其他部分 (J3.3)
PD2: 03_MCU部分 (U6.54), 05_外部接口与其他部分 (J3.4)